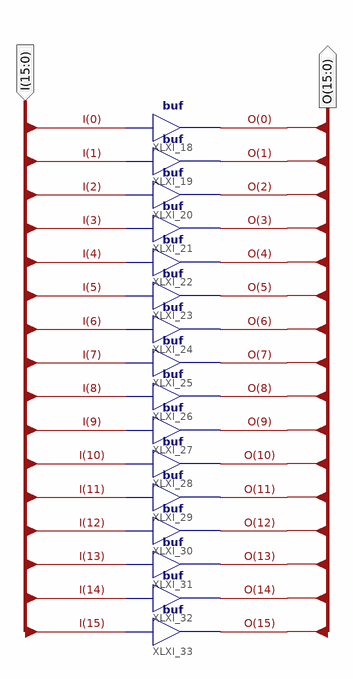
[diagram p0: schematic sheet 1]
// Xilinx ISE schematic buf16b.sch (spartan6) as structural Verilog: 16 symbols, 2 ports
module buf16b (
  input  [15:0] I,
  output [15:0] O
);

  buf XLXI_18 (O[0], I[0]);
  buf XLXI_19 (O[1], I[1]);
  buf XLXI_20 (O[2], I[2]);
  buf XLXI_21 (O[3], I[3]);
  buf XLXI_22 (O[4], I[4]);
  buf XLXI_23 (O[5], I[5]);
  buf XLXI_24 (O[6], I[6]);
  buf XLXI_25 (O[7], I[7]);
  buf XLXI_26 (O[8], I[8]);
  buf XLXI_27 (O[9], I[9]);
  buf XLXI_28 (O[10], I[10]);
  buf XLXI_29 (O[11], I[11]);
  buf XLXI_30 (O[12], I[12]);
  buf XLXI_31 (O[13], I[13]);
  buf XLXI_32 (O[14], I[14]);
  buf XLXI_33 (O[15], I[15]);
endmodule
